# EAGLE schematic Capstone Robot Circuit (EAGLE 9.5.2)
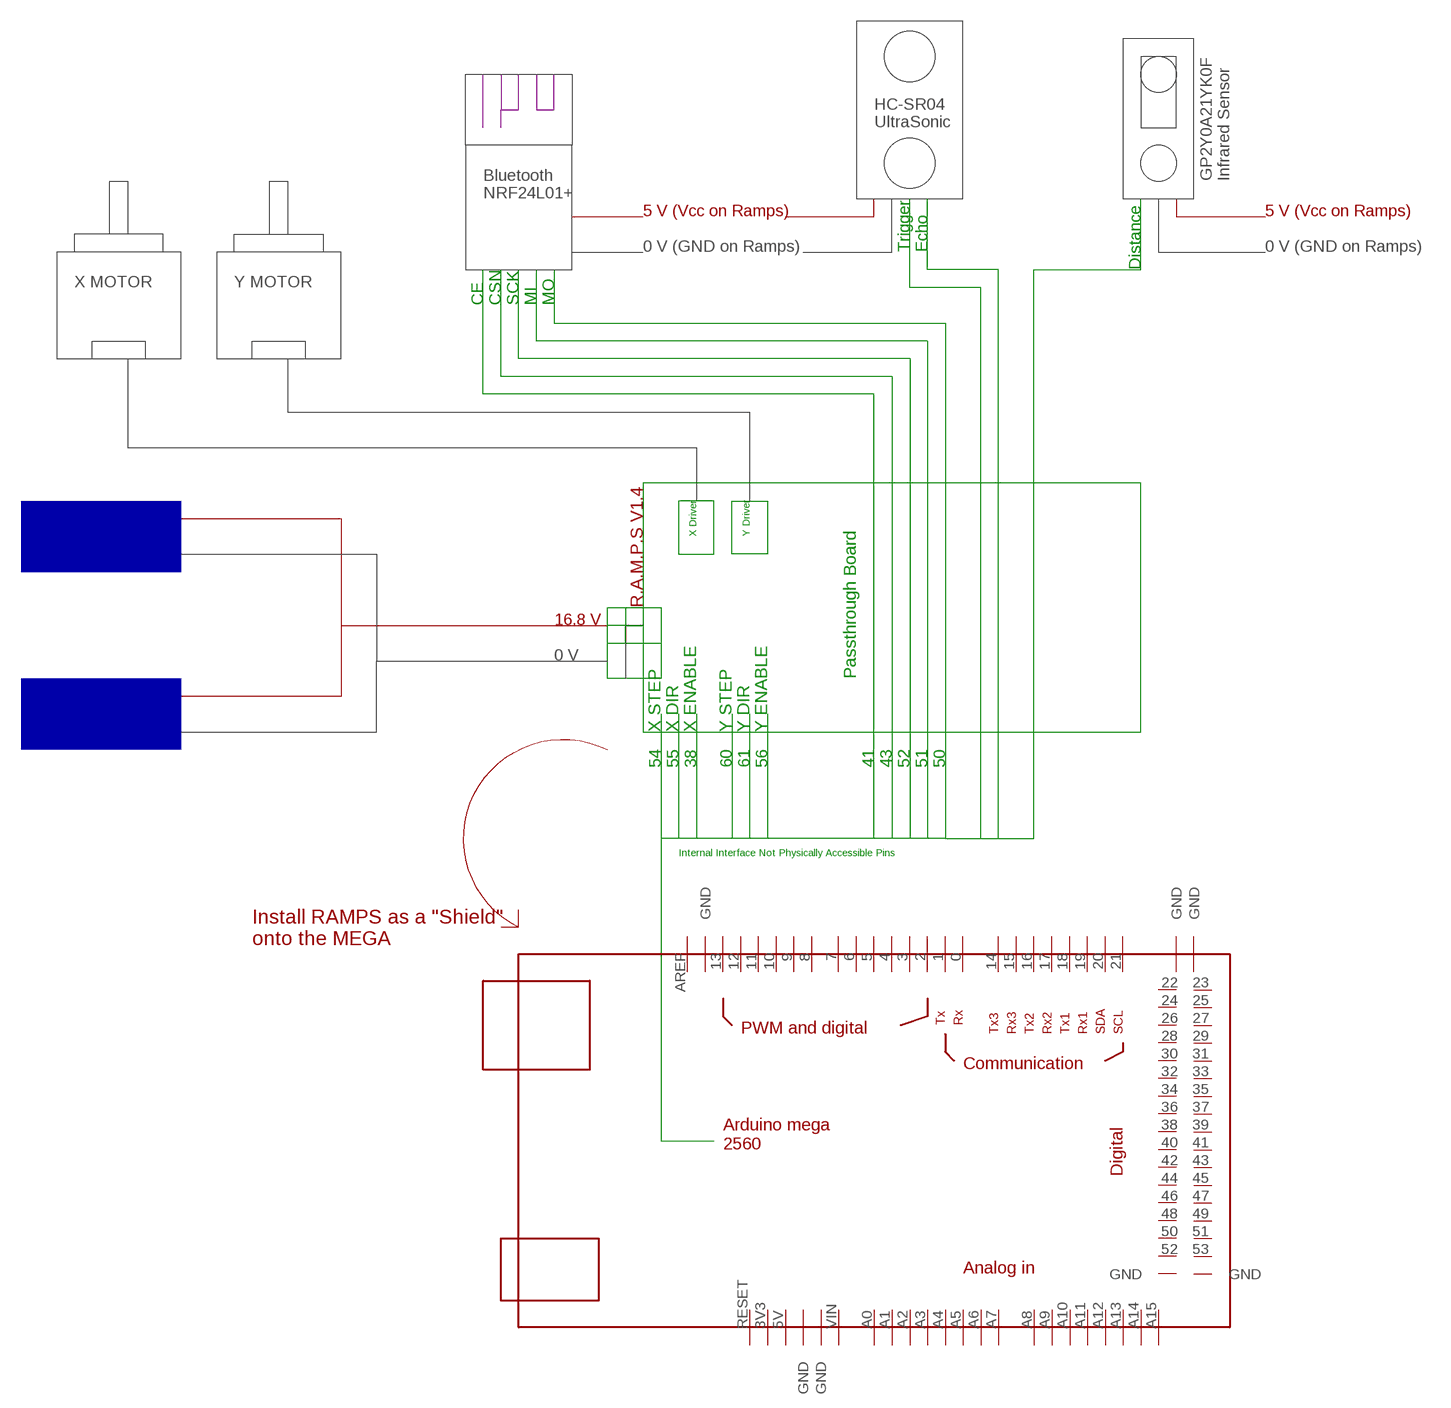
[diagram p0: schematic, sheet 1]

## Parts
U$1  MEGA_DEVICE  [MEGAOUTLINE]
Unconnected: U$1.0 U$1.1 U$1.2 U$1.3 U$1.3V3 U$1.4 U$1.5 U$1.5V U$1.6 U$1.7 U$1.8 U$1.9 U$1.10 U$1.11 U$1.12 U$1.13 U$1.14 U$1.15 U$1.16 U$1.17 U$1.18 U$1.19 U$1.20 U$1.21 U$1.22 U$1.23 U$1.24 U$1.25 U$1.26 U$1.27 U$1.28 U$1.29 U$1.30 U$1.31 U$1.32 U$1.33 U$1.34 U$1.35 U$1.36 U$1.37 U$1.38 U$1.39 U$1.40 U$1.41 U$1.42 U$1.43 U$1.44 U$1.45 U$1.46 U$1.47 U$1.48 U$1.49 U$1.50 U$1.51 U$1.52 U$1.53 U$1.A0 U$1.A1 U$1.A2 U$1.A3 U$1.A4 U$1.A5 U$1.A6 U$1.A7 U$1.A8 U$1.A9 U$1.A10 U$1.A11 U$1.A12 U$1.A13 U$1.A14 U$1.A15 U$1.AREF U$1.GND@1(GND) U$1.GND@2(GND) U$1.GND@3(GND) U$1.GND@4(GND) U$1.GND@5(GND) U$1.GND@6(GND) U$1.GND@7(GND) U$1.RESET U$1.VIN

## Notes on the sheet
- HC-SR04
  UltraSonic
- GP2Y0A21YK0F
  Infrared Sensor
- Bluetooth
  NRF24L01+
- 5 V (Vcc on Ramps) | 5 V (Vcc on Ramps)
- 0 V (GND on Ramps) | Trigger | Echo | 0 V (GND on Ramps)
- Distance
- X MOTOR | Y MOTOR
- CE | CSN | SCK | MI | MO
- X Driver | Y Driver
- Lipo Battery
  4S 1300mAh
- R.A.M.P.S V1.4
- 16.8 V
- 0 V
- Passthrough Board
- Lipo Battery
  4S 1300mAh
- X STEP | X DIR | X ENABLE | Y STEP | Y DIR | Y ENABLE
- 54 | 55 | 38 | 60 | 61 | 56 | 41 | 43 | 52 | 51 | 50
- Internal Interface Not Physically Accessible Pins
- Install RAMPS as a "Shield"
  onto the MEGA

## Library data of the parts
U$1 = ArduinoMegaOutline:MEGA_DEVICE: mega card as device